# Altium schematic sheet 03-PulseGenerator.SchDoc
size A4; DocumentNumber: 3; SheetNumber: 3; SheetTotal: 26
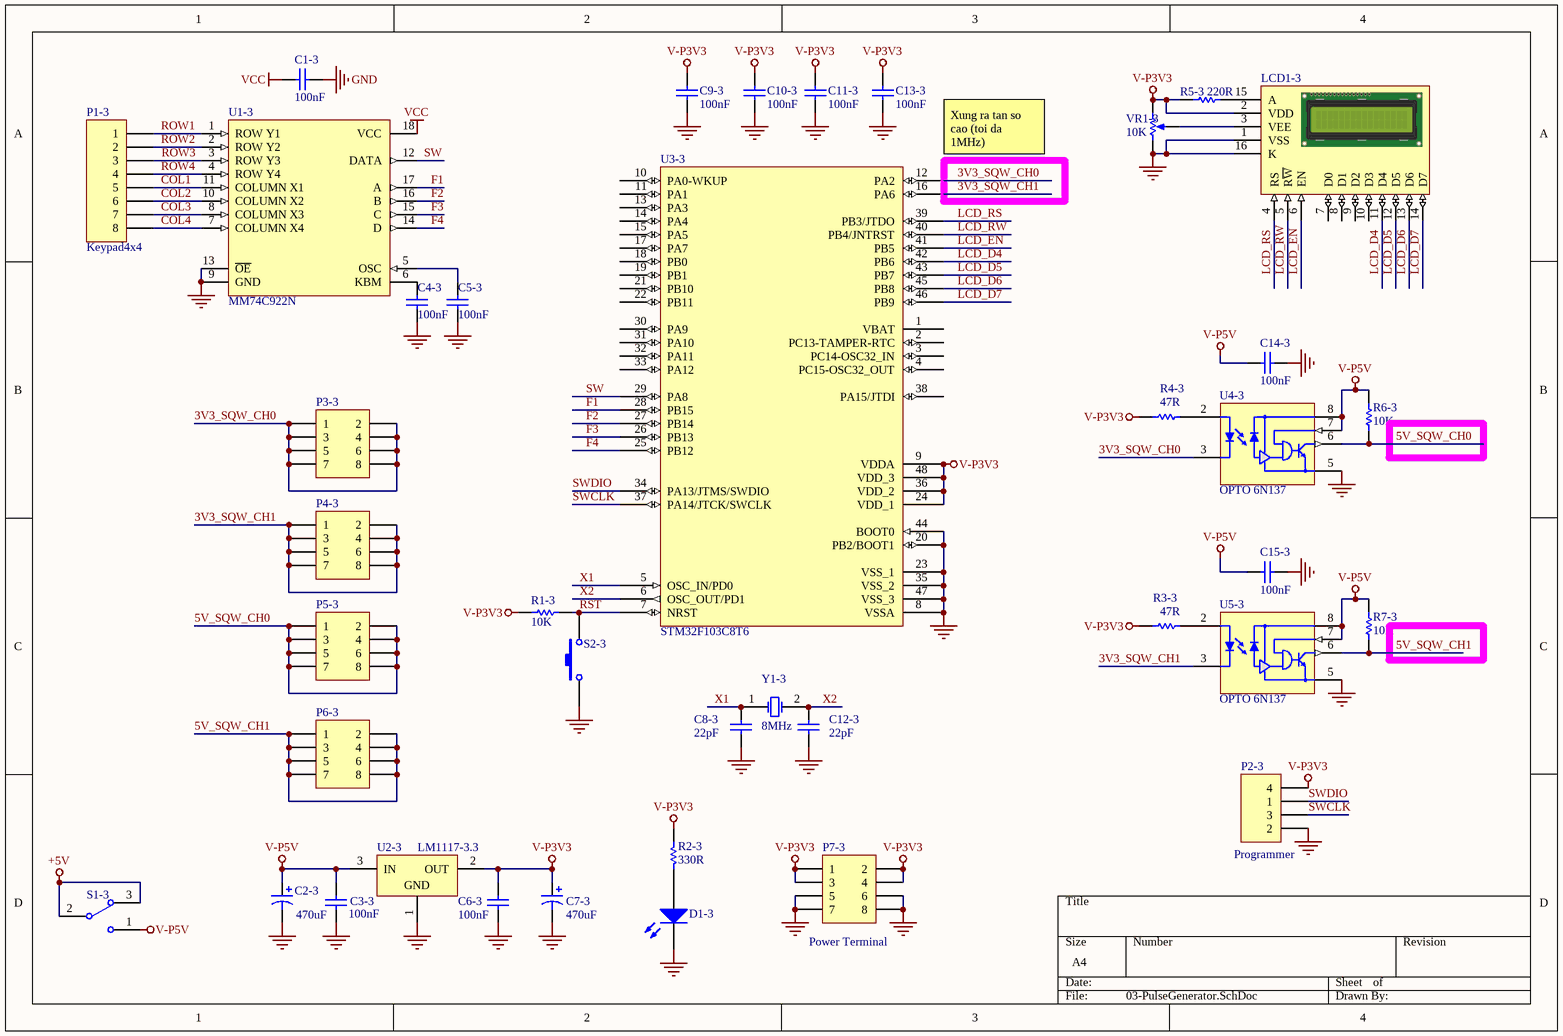
[diagram p0: 03-PulseGenerator.SchDoc]

## Parts
C1-3  value 100nF  [c-0805]  (hidden comment: 104)
C2-3  value 470uF  [C-ALU-10x10mm]  (hidden comment: 470uF/16V)
C3-3  value 100nF  [c-0805]  (hidden comment: 104)
C4-3  value 100nF  [c-0805]  (hidden comment: 104)
C5-3  value 100nF  [c-0805]  (hidden comment: 104)
C6-3  value 100nF  [c-0805]  (hidden comment: 104)
C7-3  value 470uF  [C-ALU-10x10mm]  (hidden comment: 470uF/16V)
C8-3  value 22pF  [c-0805]  (hidden comment: 22)
C9-3  value 100nF  [c-0805]  (hidden comment: 104)
C10-3  value 100nF  [c-0805]  (hidden comment: 104)
C11-3  value 100nF  [c-0805]  (hidden comment: 104)
C12-3  value 22pF  [c-0805]  (hidden comment: 22)
C13-3  value 100nF  [c-0805]  (hidden comment: 104)
C14-3  value 100nF  [c-0805]  (hidden comment: 104)
C15-3  value 100nF  [c-0805]  (hidden comment: 104)
D1-3  LED  [LED-0805]  (value not drawn)
LCD1-3  LCD1602  [LCD-1602A]  (value not drawn)
P1-3  Keypad4x4  [KEYPAD-4x4A]
P2-3  value Programmer  [JP2.54-M-1x04A]  (hidden comment: H4)
P3-3  Header 4X2  [JP2.54-F-2x04A]  (value not drawn)
P4-3  Header 4X2  [JP2.54-F-2x04A]  (value not drawn)
P5-3  Header 4X2  [JP2.54-F-2x04A]  (value not drawn)
P6-3  Header 4X2  [JP2.54-F-2x04A]  (value not drawn)
P7-3  Publisher: Power Terminal  [JP2.54-F-2x04A]  (hidden comment: Header 4X2)
R1-3  value 10K  [R-0805]  (hidden comment: Res1)
R2-3  value 330R  [R-0805]  (hidden comment: 331)
R3-3  47R  [R-0805]
R4-3  47R  [R-0805]
R5-3  220R  [R-0805]
R6-3  value 10K  [R-0805]  (hidden comment: Res1)
R7-3  value 10K  [R-0805]  (hidden comment: Res1)
S1-3  SW-SPDT  [SW-SLIDE-2P-2W]  (value not drawn)
S2-3  SW-S6  [SW-T-S6-SMD]  (value not drawn)
U1-3  MM74C922N  [SK-DIP18-300]
U2-3  LM1117-3.3  [SOT-223-3]
U3-3  STM32F103C8T6  [LQFP-48]
U4-3  OPTO 6N137  [DIP8-300-SMD]
U5-3  OPTO 6N137  [DIP8-300-SMD]
VR1-3  10K  [VR-3362P]
Y1-3  8MHz  [XTAL-CSM7]

## Nets
+5V: S1-3.2 S1-3.3
GND: C1-3.2 C2-3.2 C3-3.1 C4-3.2 C5-3.2 C6-3.1 C7-3.2 C8-3.1 C9-3.1 C10-3.1 C11-3.1 C12-3.1 C13-3.1 C14-3.1 C15-3.1 D1-3.2(K) LCD1-3.1(VSS) LCD1-3.16(K) P2-3.2 P7-3.5 P7-3.6 P7-3.7 P7-3.8 S2-3.1 U1-3.9(GND) U1-3.13(~{OE}) U2-3.1(GND) U3-3.8(VSSA) U3-3.20(PB2/BOOT1) U3-3.23(VSS_1) U3-3.35(VSS_2) U3-3.44(BOOT0) U3-3.47(VSS_3) U4-3.5(GND) U5-3.5(GND) VR1-3.1(TOP)
V-P3V3: C6-3.2 C7-3.1 C9-3.2 C10-3.2 C11-3.2 C13-3.2 LCD1-3.2(VDD) P2-3.4 P7-3.1 P7-3.2 P7-3.3 P7-3.4 R1-3.2 R2-3.1 R3-3.1 R4-3.1 R5-3.1 U2-3.2(OUT) U3-3.9(VDDA) U3-3.24(VDD_1) U3-3.36(VDD_2) U3-3.48(VDD_3) VR1-3.3(BOT)
V-P5V: C2-3.1 C3-3.2 C14-3.2 C15-3.2 R6-3.1 R7-3.1 S1-3.1 U2-3.3(IN) U4-3.7(EN) U4-3.8(VCC) U5-3.7(EN) U5-3.8(VCC)
VCC: C1-3.1 U1-3.18(VCC)
3V3_SQW_CH0: P3-3.1 P3-3.2 P3-3.3 P3-3.4 P3-3.5 P3-3.6 P3-3.7 P3-3.8 U3-3.12(PA2) U4-3.3(VF-)
3V3_SQW_CH1: P4-3.1 P4-3.2 P4-3.3 P4-3.4 P4-3.5 P4-3.6 P4-3.7 P4-3.8 U3-3.16(PA6) U5-3.3(VF-)
5V_SQW_CH0: P5-3.1 P5-3.2 P5-3.3 P5-3.4 P5-3.5 P5-3.6 P5-3.7 P5-3.8 R6-3.2 U4-3.6(Vo)
5V_SQW_CH1: P6-3.1 P6-3.2 P6-3.3 P6-3.4 P6-3.5 P6-3.6 P6-3.7 P6-3.8 R7-3.2 U5-3.6(Vo)
COL1: P1-3.5 U1-3.11(COLUMN_X1)
COL2: P1-3.6 U1-3.10(COLUMN_X2)
COL3: P1-3.7 U1-3.8(COLUMN_X3)
COL4: P1-3.8 U1-3.7(COLUMN_X4)
F1: U1-3.17(A) U3-3.28(PB15)
F2: U1-3.16(B) U3-3.27(PB14)
F3: U1-3.15(C) U3-3.26(PB13)
F4: U1-3.14(D) U3-3.25(PB12)
LCD_D4: LCD1-3.11(D4) U3-3.42(PB6)
LCD_D5: LCD1-3.12(D5) U3-3.43(PB7)
LCD_D6: LCD1-3.13(D6) U3-3.45(PB8)
LCD_D7: LCD1-3.14(D7) U3-3.46(PB9)
LCD_EN: LCD1-3.6(EN) U3-3.41(PB5)
LCD_RS: LCD1-3.4(RS) U3-3.39(PB3/JTDO)
LCD_RW: LCD1-3.5(R~{W}) U3-3.40(PB4/JNTRST)
ROW1: P1-3.1 U1-3.1(ROW_Y1)
ROW2: P1-3.2 U1-3.2(ROW_Y2)
ROW3: P1-3.3 U1-3.3(ROW_Y3)
ROW4: P1-3.4 U1-3.4(ROW_Y4)
RST: R1-3.1 S2-3.2 U3-3.7(NRST)
SW: U1-3.12(DATA) U3-3.29(PA8)
SWCLK: P2-3.3 U3-3.37(PA14/JTCK/SWCLK)
SWDIO: P2-3.1 U3-3.34(PA13/JTMS/SWDIO)
X1: C8-3.2 U3-3.5(OSC_IN/PD0) Y1-3.1(OSC1)
X2: C12-3.2 U3-3.6(OSC_OUT/PD1) Y1-3.2(OSC2)
NetC4-3_1: C4-3.1 U1-3.6(KBM)
NetC5-3_1: C5-3.1 U1-3.5(OSC)
NetD1-3_1: D1-3.1(A) R2-3.2
NetLCD1-3_3: LCD1-3.3(VEE) VR1-3.2(TAP)
NetLCD1-3_15: LCD1-3.15(A) R5-3.2
NetR3-3_2: R3-3.2 U5-3.2(VF+)
NetR4-3_2: R4-3.2 U4-3.2(VF+)

Not connected (* = marked no-connect by the designer): LCD1-3 7(D0) 8(D1) 9(D2) 10(D3); U3-3 1(VBAT) 2(PC13-TAMPER-RTC) 3(PC14-OSC32_IN) 4(PC15-OSC32_OUT) 10(PA0-WKUP) 11(PA1) 13(PA3) 14(PA4) 15(PA5) 17(PA7) 18(PB0) 19(PB1) 21(PB10) 22(PB11) 30(PA9) 31(PA10) 32(PA11) 33(PA12) 38(PA15/JTDI); U4-3 1(NC) 4(NC); U5-3 1(NC) 4(NC)

## Notes on the sheet
- Xung ra tan so cao (toi da 1MHz)

## Library data of the parts
C1-3 C4-3 C5-3 = Cap: CAP CER 0.1UF 50V Y5V 0805; Manufacturer: Yageo; Manufacturer Part Number: CC0805ZRY5V9BB104; Capacitance: 0.10µF; Tolerance: -20%, +80%; Temperature Coefficient: Y5V (F); Supplier 1: Digi-Key; Supplier Part Number 1: 311-1361-1-ND; RoHS: RoHS Compliant; Category: Capacitors; Stock 1: 348816; Pricing 1: 1=0.1, 10=0.033, 25=0.0232, 100=0.0151, 250=0.01232, 500=0.01056, 1000=0.00822 (USD); Packaging: Cut Tape (CT); Part Status: Active; Voltage - Rated: 50V; Mounting Type: Surface Mount, MLCC; Operating Temperature: -30°C ~ 85°C; Applications: General Purpose; Ratings: -; Package / Case: 0805 (2012 Metric); Size / Dimension: 0.079" L x 0.049" W (2.00mm x 1.25mm); Height - Seated (Max): -; Thickness (Max): 0.024" (0.60mm); Lead Spacing: -; Features: -; Lead Style: -; ComponentLink1URL: http://www.yageo.com/documents/recent/UPY-GPHC_Y5V_6.3V-to-50V_6.pdf; ComponentLink1Description: http://www.yageo.com/documents/recent/UPY-GPHC_Y5V_6.3V-to-50V_6.pdf
C2-3 C7-3 = Cap Pol1: Polarized Capacitor (Radial); Published: 8-Jun-2000; LatestRevisionDate: 17-Jul-2002; LatestRevisionNote: Re-released for DXP Platform.; PackageReference: RB7.6-15; Publisher: Altium Limited
C3-3 C6-3 C8-3 C12-3 = Cap: Capacitor; Manufacturer: Generic Components; Class: Passive; Published: 08/06/2000; Publisher: Altium Hobart Technology Centre; SubClass: Capacitor
C9-3 C10-3 C11-3 C13-3 C14-3 C15-3 = Cap: Capacitor; Published: 8-Jun-2000; LatestRevisionDate: 17-Jul-2002; LatestRevisionNote: Re-released for DXP Platform.; PackageReference: RAD-0.3; Publisher: Altium Limited; PackageDescription: Radial Cap, Thru-Hole; 2 Leads; 0.3 in Pin Spacing
D1-3 = LED0: Typical INFRARED GaAs LED; Published: 8-Jun-2000; LatestRevisionDate: 08-Jul-2005; LatestRevisionNote: Mech Layer 1 removed.; PackageReference: LED-0; Publisher: Altium Limited; Value: LED
LCD1-3 = LCD1602: Liquid Crystal Display; Value: LCD1602
P1-3 = Header 8: Header, 8-Pin; LatestRevisionDate: 17-Jul-2002; LatestRevisionNote: Re-released for DXP Platform.; Publisher: Altium Limited
P2-3 = Header 4: Header, 4-Pin; LatestRevisionDate: 17-Jul-2002; LatestRevisionNote: Re-released for DXP Platform.
P3-3 P4-3 P5-3 P6-3 P7-3 = Header 4X2: Header, 4-Pin, Dual row; LatestRevisionDate: 17-Jul-2002; LatestRevisionNote: Re-released for DXP Platform.
  P3-3 P4-3 P5-3 P6-3: Publisher: Power Terminal
R1-3 R2-3 R3-3 R4-3 R5-3 R6-3 R7-3 = Res1: Resistor; Published: 8-Jun-2000; LatestRevisionDate: 17-Jul-2002; LatestRevisionNote: Re-released for DXP Platform.; PackageReference: AXIAL-0.3; Publisher: Altium Limited
  R3-3 R4-3: Value: 47R
  R5-3: PackageDescription: Axial Device, Thru-Hole; 2 Leads; 0.3 in Pin Spacing; Value: 220R
S1-3 = SW-SPDT: SPDT Subminiature Toggle Switch, Right Angle Mounting, Vertical Actuation; Link: http://banlinhkien.vn/goods-5937-cong-tac-gat-6-chan-mss22d18-smd.html
S2-3 = SW-PB: Switch; Value: Reset; Published: 24-Mar-1999; LatestRevisionDate: 17-Jul-2002; LatestRevisionNote: Re-released for DXP Platform.; PackageReference: SPST-2; PackageDescription: Switch; 2 Leads
U2-3 = LM1117IDTX-3.3: 800mA Low-Dropout Linear Regulator, 3-pin TO-252; Manufacturer: National Semiconductor; PackageTopMarking: NSUZXYTT*LM1117*IDT-3.3; PowerWise: N; CompType: LDO IC; Published: 1-Mar-2010; DatasheetVersion: Apr-2006; PackageVersion: revD, Feb-2009; PackageReference: TD03B; Publisher: Altium Limited; PackageDescription: TO252, Molded, Jedec, 6.8 x 6.10 x 2.30mm Body, 3 Lead, 2.28mm Pitch, Surface Mount; PartNumber: LM1117IDTX-3.3; Value: LM1117-3.3; PinCount: 3; Code_JEDEC: TO-252-AA; ComponentLink1Description: LM1117 Datasheet; ComponentLink1URL: http://www.national.com/ds/LM/LM1117.pdf; ComponentLink2Description: LM1117 Web Page; ComponentLink2URL: http://www.national.com/pf/LM/LM1117.html; ComponentLink3Description: TD03B Package Page; ComponentLink3URL: http://www.national.com/packaging/folders/td03b.html
U3-3 = STM32F103C8T6: STM32 ARM-based 32-bit MCU with 64 Kbytes Flash, 48-pin LQFP, Industrial Temperature; Published: 30-May-2008; DatasheetVersion: rev6, Mar-2008; PackageVersion: Mar-2008; PackageReference: LQFP48; Publisher: Altium Limited; PackageDescription: 48-Pin Low-Profile Quad Flat Pack, 7 x 7 mm Body, 0.5 mm Pitch (LQFP48); ComponentLink1Description: Manufacturer Link; ComponentLink1URL: www.st.com/stm32; ComponentLink2Description: Datasheet; ComponentLink2URL: http://www.st.com/stonline/products/literature/ds/13587.pdf
U4-3 U5-3 = OPTO 6N137: High Speed 10MBit/s Logic Gata Optocouplers; Value: 6N137
VR1-3 = RPot: Potentiometer; Sim Note: Enter the Resistance value and the set point into parameter fields.; Set Position: 0.5; Published: 8-Jun-2000; LatestRevisionDate: 17-Jul-2002; LatestRevisionNote: Re-released for DXP Platform.; PackageReference: VR5; Publisher: Altium Limited; PackageDescription: Variable Resistor, Thru-Hole; 3 Leads; Value: 10K
Y1-3 = XTAL: Crystal Oscillator; Published: 8-Jun-2000; LatestRevisionDate: 17-Jul-2002; LatestRevisionNote: Re-released for DXP Platform.; PackageReference: R38; Value: 8MHz; PackageDescription: Crystal, Thru-Hole; 2 Leads; Body 3.1 x 8.2 mm (Dia.xH)